# Altium schematic sheet Gyro.SchDoc
size A4; SheetNumber: 6; SheetTotal: 13
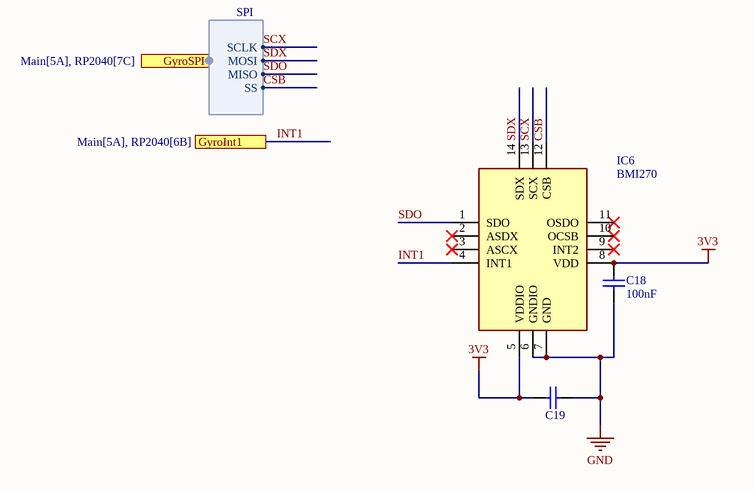
[diagram p0: Gyro.SchDoc]

## Parts
C18  100nF  [0402 cap]
C19  100nF  [WCAP-CSGP_0603_L1.6W0.8H0.8_Reflow]  (value not drawn)
IC6  BMI270  [QFN50P300X250X87-14N]

## Ports
GyroInt1 (see Main[5A], RP2040[6B]), GyroSPI (harness SPI, see Main[5A], RP2040[7C])

## Harnesses
SPI: SS, MISO, MOSI, SCLK

## Nets
3V3: C18.2 C19.2 IC6.5(VDDIO) IC6.8(VDD)
GND: C18.1 C19.1 IC6.6(GNDIO) IC6.7(GND)
CSB: IC6.12(CSB) ; port GyroSPI.SS
INT1: IC6.4(INT1) ; port GyroInt1
SCX: IC6.13(SCX) ; port GyroSPI.SCLK
SDO: IC6.1(SDO) ; port GyroSPI.MISO
SDX: IC6.14(SDX) ; port GyroSPI.MOSI

Not connected (* = marked no-connect by the designer): IC6 2(ASDX)* 3(ASCX)* 9(INT2)* 10(OCSB)* 11(OSDO)*

## Library data of the parts
C18 = Capacitor 0402 100nF: Value: 100nF
C19 = 885012206095: WCAP-CSGP Multilayer Ceramic Chip Capacitor, General Purpose, size 0603, X7R, 100nF, 50VDC; Manufacturer: Wurth Elektronik; Case/Size Code: 0603; Capacitance Tolerance: +/-10%; Dissipation Factor: 3%; Insulation Resistance: 5GΩ; Rated Voltage (DC): 50V; Technical Reference: X7R0603104K050DFCT10000; Manufacturer Part Number: 885012206095; Category: Multilayer Ceramic Chip Capacitors; Match Code: WCAP-CSGP; ComponentLink1Description: Website Link; ComponentLink1URL: https://www.we-online.com/redexpert/article/885012206095?ad; ComponentLink2Description: Datasheet Link; ComponentLink2URL: https://www.we-online.com/redexpert/spec/885012206095?ad; Mount: Surface Mount; Operating Temperature Max: 125°C; Operating Temperature Min: -55°C; Packaging: Tape and Reel; Length: 1.6mm; Width: 0.8mm; Height: 0.8mm; Capacitance: 100nF; Ceramic Type: X7R
IC6 = BMI270: Integrated Circuit; Manufacturer_Name: BOSCH; Datasheet Link: https://www.mouser.de/datasheet/2/783/BST-BMI270-FL000-1530947.pdf; Height: 0.87mm; Manufacturer_Part_Number: BMI270; Mouser Part Number: 262-BMI270; Mouser Price/Stock: https://www.mouser.co.uk/ProductDetail/Bosch-Sensortec/BMI270?qs=u16ybLDytRYIj%252BjQEee88A%3D%3D; Arrow Part Number: BMI270; Arrow Price/Stock: https://www.arrow.com/en/products/bmi270/bosch?region=nac